# EAGLE design Blutdruck (EAGLE 9.3.1)
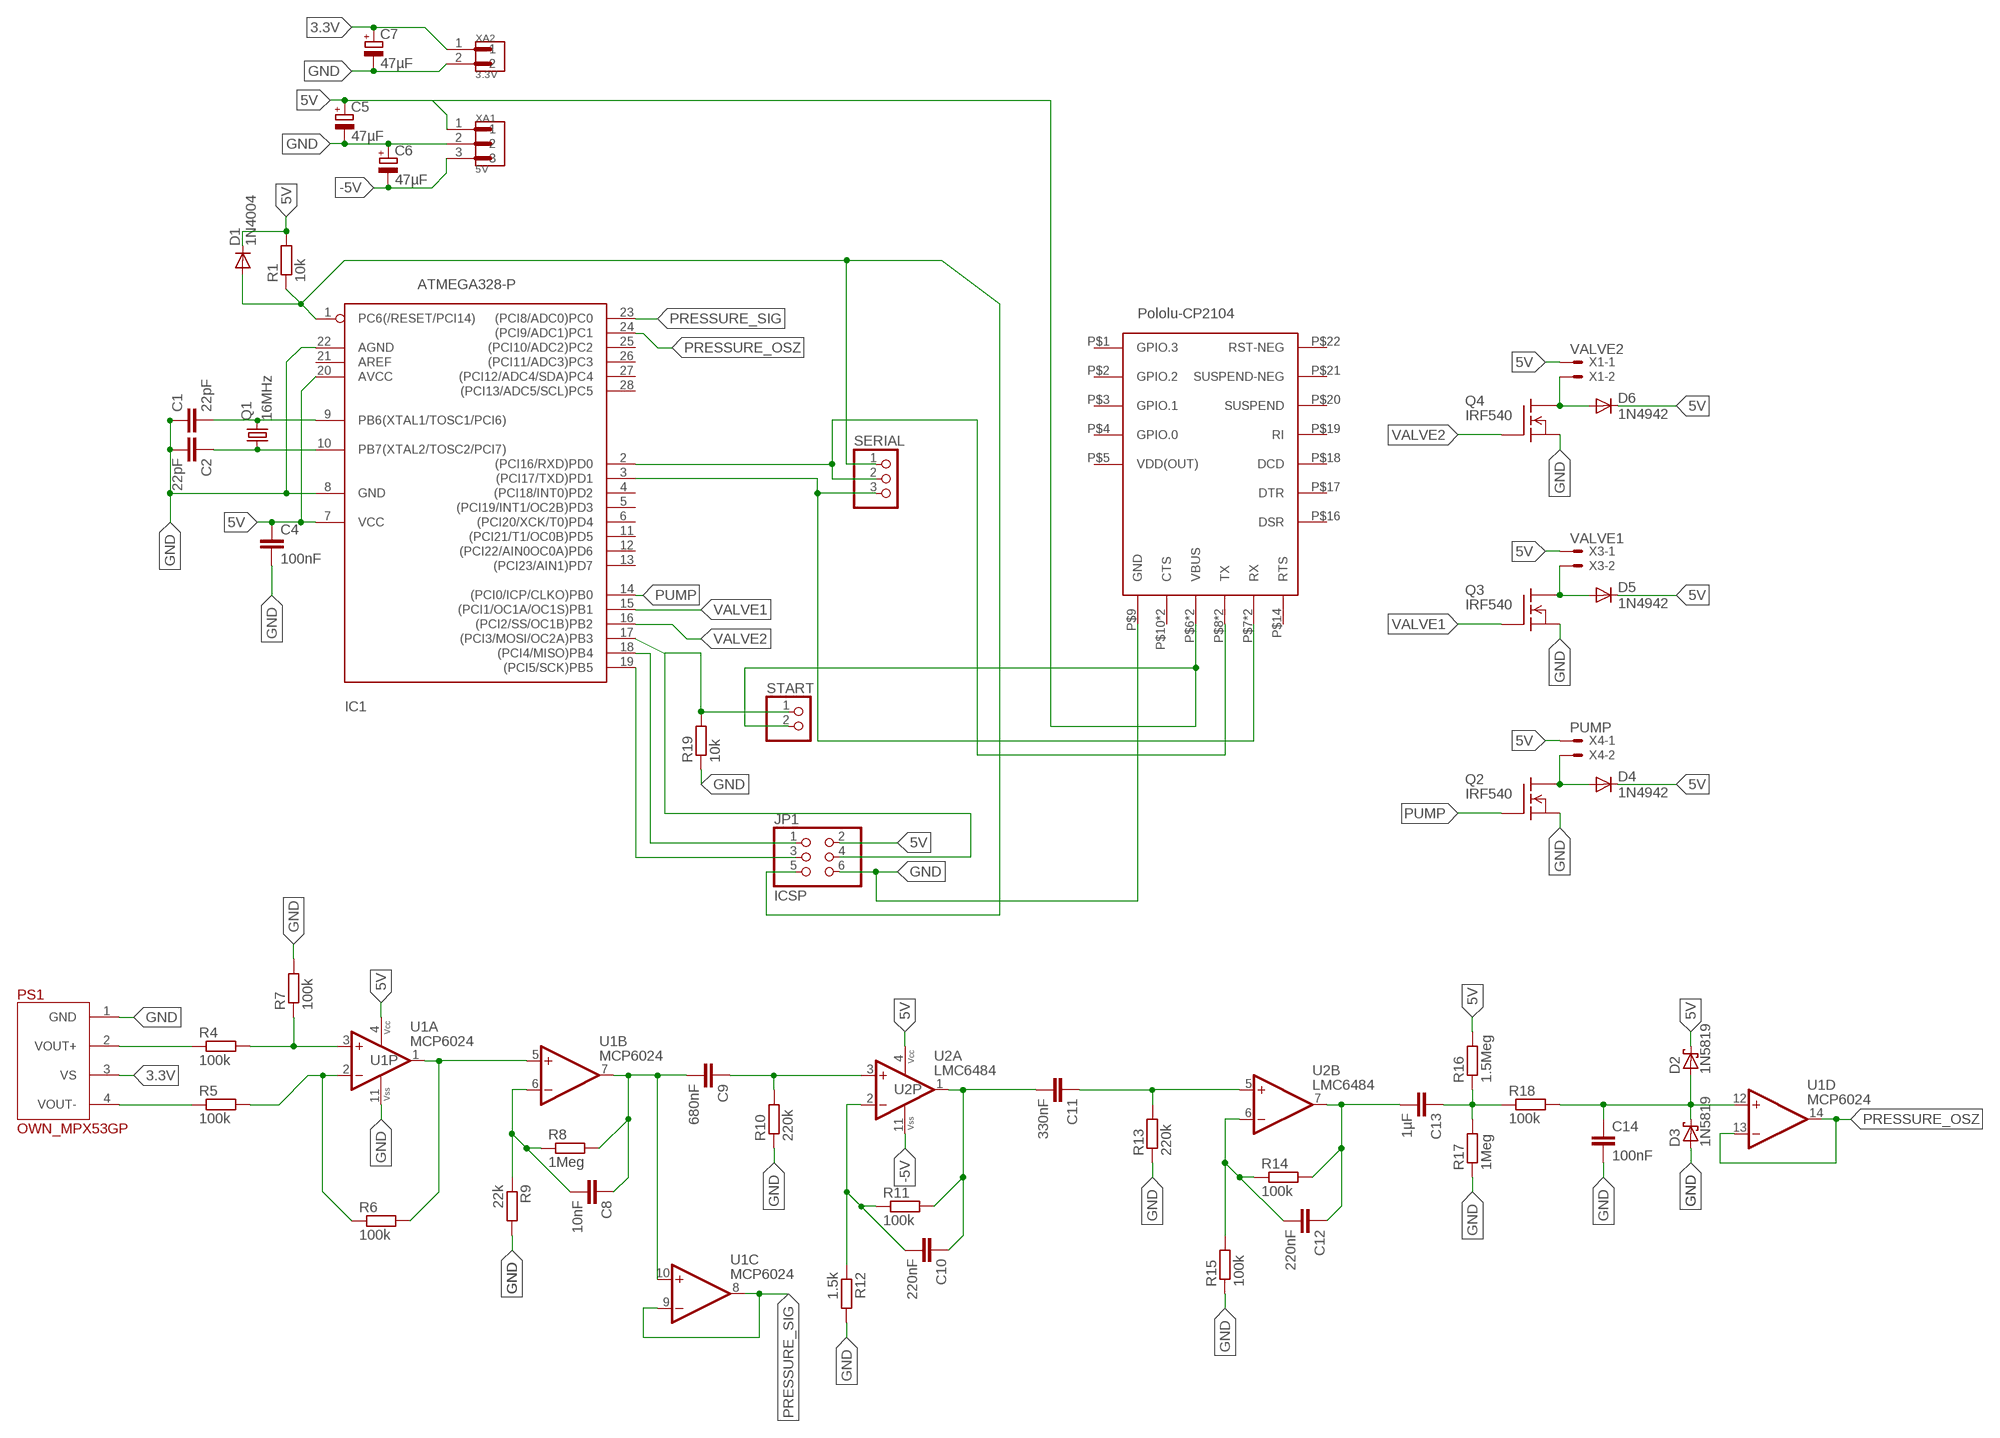
[diagram p0: schematic, sheet 1]

## Parts
C1  22pF  C-EU025-024X044  [C025-024X044]
C2  22pF  C-EU025-024X044  [C025-024X044]
C4  100nF  C-EU025-024X044  [C025-024X044]
C5  47µF  CPOL-EUE2,5-6E  [E2,5-6E]
C6  47µF  CPOL-EUE2,5-6E  [E2,5-6E]
C7  47µF  CPOL-EUE2,5-6E  [E2,5-6E]
C8  10nF  C-EU025-024X044  [C025-024X044]
C9  680nF  C-EU150-064X183  [C150-064X183]
C10  220nF  C-EU025-024X044  [C025-024X044]
C11  330nF  C-EU050-030X075  [C050-030X075]
C12  220nF  C-EU025-024X044  [C025-024X044]
C13  1µF  C-EU150-072X183  [C150-072X183]
C14  100nF  C-EU025-024X044  [C025-024X044]
D1  1N4004  [DO41-10]
D2  1N5819  SCHOTTKY-DIODEF126Z12  [F126Z12]
D3  1N5819  SCHOTTKY-DIODEF126Z12  [F126Z12]
D4  1N4942  [DO41-10]
D5  1N4942  [DO41-10]
D6  1N4942  [DO41-10]
IC1  ATMEGA328-P  ATMEGA168-20P  [DIL28-3]
JP1  ICSP  PINHD-2X3  [2X03]
PS1  OWN_MPX53GP  [MPX53]
Q1  16MHz  CRYSTALHC49U70  [HC49U70]
Q2  IRF540  [TO220]
Q3  IRF540  [TO220]
Q4  IRF540  [TO220]
R1  10k  R-EU_0204/7  [0204/7]
R4  100k  R-EU_0204/7  [0204/7]
R5  100k  R-EU_0204/7  [0204/7]
R6  100k  R-EU_0204/7  [0204/7]
R7  100k  R-EU_0204/7  [0204/7]
R8  1Meg  R-EU_0204/7  [0204/7]
R9  22k  R-EU_0204/7  [0204/7]
R10  220k  R-EU_0204/7  [0204/7]
R11  100k  R-EU_0204/7  [0204/7]
R12  1.5k  R-EU_0204/7  [0204/7]
R13  220k  R-EU_0204/7  [0204/7]
R14  100k  R-EU_0204/7  [0204/7]
R15  100k  R-EU_0204/7  [0204/7]
R16  1.5Meg  R-EU_0204/7  [0204/7]
R17  1Meg  R-EU_0204/7  [0204/7]
R18  100k  R-EU_0204/7  [0204/7]
R19  10k  R-EU_0204/7  [0204/7]
SERIAL  PINHD-1X3  [1X03]
START  PINHD-1X2  [1X02]
U1  MCP6024  LMV824  [DIL14]
U2  LMC6484  LMV824  [DIL14]
U$1  POLOLU_CP2104  [POLOLUCP2104]
X1  VALVE2  JST-XH-02-PIN-LONG-PAD  [JST-XH-02-PACKAGE-LONG-PAD]
X3  VALVE1  JST-XH-02-PIN-LONG-PAD  [JST-XH-02-PACKAGE-LONG-PAD]
X4  PUMP  JST-XH-02-PIN-LONG-PAD  [JST-XH-02-PACKAGE-LONG-PAD]
XA1  5V  B3P-VH(LF)(SN)  [JST_B3P-VH(LF)(SN)]
XA2  3.3V  B2P-VH(LF)(SN)  [JST_B2P-VH(LF)(SN)]

## Nets
3.3V [supply]: C7.+ PS1.3(VS) XA2.1
5V [supply]: C4.1 C5.+ D1.C D2.C D4.C D5.C D6.C IC1.7(VCC) IC1.20(AVCC) JP1.2 R1.2 R16.2 START.2 U1.4(P:VCC+) U2.4(P:VCC+) U$1.P$6(VBUS) U$1.P$11(VBUS) X1.1 X3.1 X4.1 XA1.1
-5V [supply]: C6.- U2.11(P:VCC-) XA1.3
GND [supply]: C1.1 C2.2 C4.2 C5.- C6.+ C7.- C14.2 D3.A IC1.8(GND) IC1.22(AGND) JP1.6 PS1.1(GND) Q2.3(S) Q3.3(S) Q4.3(S) R7.2 R9.2 R10.1 R12.2 R13.1 R15.1 R17.1 R19.1 U1.11(P:VCC-) U$1.P$9(GND) XA1.2 XA2.2
N$1: PS1.2(VOUT+) R4.1
N$2: R4.2 R7.1 U1.3(A:+IN)
N$3: PS1.4(VOUT-) R5.1
N$4: R5.2 R6.1 U1.2(A:-IN)
N$5: R6.2 U1.1(A:OUT) U1.5(B:+IN)
N$6: C8.2 R8.1 R9.1 U1.6(B:-IN)
N$7: C8.1 C9.2 R8.2 U1.7(B:OUT) U1.10(C:+IN)
N$8: C9.1 R10.2 U2.3(A:+IN)
N$9: C10.2 R11.1 R12.1 U2.2(A:-IN)
N$10: C10.1 C11.2 R11.2 U2.1(A:OUT)
N$11: C11.1 R13.2 U2.5(B:+IN)
N$12: C12.2 R14.1 R15.2 U2.6(B:-IN)
N$13: C12.1 C13.2 R14.2 U2.7(B:OUT)
N$14: C13.1 R16.1 R17.2 R18.1
N$15: C14.1 D2.A D3.C R18.2 U1.12(D:+IN)
N$16: D4.A Q2.2(D) X4.2
N$17: D5.A Q3.2(D) X3.2
N$18: D6.A Q4.2(D) X1.2
N$19: IC1.17((PCI3/MOSI/OC2A)PB3) JP1.4 R19.2 START.1
N$20: IC1.2((PCI16/RXD)PD0) SERIAL.2 U$1.P$8(TX) U$1.P$12(TX)
N$21: IC1.3((PCI17/TXD)PD1) SERIAL.3 U$1.P$7(RX) U$1.P$13(RX)
N$26: C1.2 IC1.9(PB6(XTAL1/TOSC1/PCI6)) Q1.2
N$27: C2.1 IC1.10(PB7(XTAL2/TOSC2/PCI7)) Q1.1
N$30: IC1.18((PCI4/MISO)PB4) JP1.1
N$31: IC1.19((PCI5/SCK)PB5) JP1.3
PRESSURE_OSZ: IC1.24((PCI9/ADC1)PC1) U1.13(D:-IN) U1.14(D:OUT)
PRESSURE_SIG: IC1.23((PCI8/ADC0)PC0) U1.8(C:OUT) U1.9(C:-IN)
PUMP: IC1.14((PCI0/ICP/CLKO)PB0) Q2.1(G)
RESET: D1.A IC1.1(PC6(/RESET/PCI14)) JP1.5 R1.1 SERIAL.1
VALVE1: IC1.15((PCI1/OC1A/OC1S)PB1) Q3.1(G)
VALVE2: IC1.16((PCI2/SS/OC1B)PB2) Q4.1(G)
Unconnected: IC1.4((PCI18/INT0)PD2) IC1.5((PCI19/INT1/OC2B)PD3) IC1.6((PCI20/XCK/T0)PD4) IC1.11((PCI21/T1/OC0B)PD5) IC1.12((PCI22/AIN0OC0A)PD6) IC1.13((PCI23/AIN1)PD7) IC1.21(AREF) IC1.25((PCI10/ADC2)PC2) IC1.26((PCI11/ADC3)PC3) IC1.27((PCI12/ADC4/SDA)PC4) IC1.28((PCI13/ADC5/SCL)PC5) U2.8(C:OUT) U2.9(C:-IN) U2.10(C:+IN) U2.12(D:+IN) U2.13(D:-IN) U2.14(D:OUT) U$1.P$1(GPIO.3) U$1.P$2(GPIO.2) U$1.P$3(GPIO.1) U$1.P$4(GPIO.0) U$1.P$10(CTS) U$1.P$14(RTS) U$1.P$15(CTS) U$1.P$16(DSR) U$1.P$17(DTR) U$1.P$18(DCD) U$1.P$19(RI) U$1.P$20(SUSPEND) U$1.P$21(SUSPEND-NEG) U$1.P$22(RST-NEG)

## Power pins joined to a net without a drawn wire
VDD(OUT): U$1.P$5(VDD(OUT))

## Library data of the parts
C1 C2 C4 C8-C14 = rcl:C-EU: CAPACITOR, European symbol; SPICEPREFIX: C
C5-C7 = rcl:CPOL-EU: POLARIZED CAPACITOR, European symbol; SPICEPREFIX: C
D1 = diode:1N4004: DIODE general purpose rectifier, 1 A
D2 D3 = diode:SCHOTTKY-DIODE: Schottky Diode
D4-D6 = diode:1N4942: DIODE 1.0 A, 200 V, 150 ns
IC1 = adafruit:ATMEGA168*P: MICROCONTROLLER 16 kBytes FLASH 1 kBytes SRAM 512 Bytes EEPROM USART 8-channel 10 bit ADC
JP1 = pinhead:PINHD-2X3: PIN HEADER
PS1 = OWN_MXP53GP:OWN_MPX53GP
Q1 = adafruit:CRYSTAL: CRYSTAL; OC_FARNELL: unknown; OC_NEWARK: unknown
Q2-Q4 = transistor-fet:IRF540: N-Channel Enhancement MOSFET (HEXFET); 100V; 28A; 0,077Ohm
R1 R4-R19 = rcl:R-EU_: RESISTOR, European symbol; SPICEPREFIX: R
SERIAL = pinhead:PINHD-1X3: PIN HEADER
START = pinhead:PINHD-1X2: PIN HEADER
U1 U2 = op-amp:LMV824: OP-AMP - Low Voltage Rail-to-Rail
U$1 = POLOLU_CP2104:POLOLU_CP2104: TTL zu USB Konverter
X1 X3 X4 = Rembrandt Electronics - JST XH Connectors v1-0:JST-XH-02-PIN: JST XH Connector 2 Pin Wire to board connector. Pitch: 2,54 mm, (0.100") Number of pins: 2 Created by Rembrandt Electronics www.rembrandtelectronics.com
XA1 = B3P-VH_LF__SN_:B3P-VH(LF)(SN): VH Series 3 Position 3.96 mm Pitch Through Hole Crimp Locking Header; AVAILABILITY: Good; DESCRIPTION: VH Series 3 Position 3.96 mm Pitch Through Hole Crimp Locking Header; MF: JST; MP: B3P-VH_LF__SN_; PACKAGE: FakePackage u; PRICE: 0.12 USD
XA2 = B2P-VH_LF__SN_:B2P-VH(LF)(SN): VH Series 3.96 mm Pitch, Compact, Lock Mechanism also Prevents Misinsertion; AVAILABILITY: Good; DESCRIPTION: VH Series 3.96 mm Pitch, Compact, Lock Mechanism also Prevents Misinsertion; MF: JST; MP: B2P-VH_LF__SN_; PACKAGE: FakePackage u; PRICE: 0.11 USD

## Net classes
0 signals: width 0.406 mm, clearance 0.305 mm
1 supply: width 0.61 mm, clearance 0.406 mm

## Board
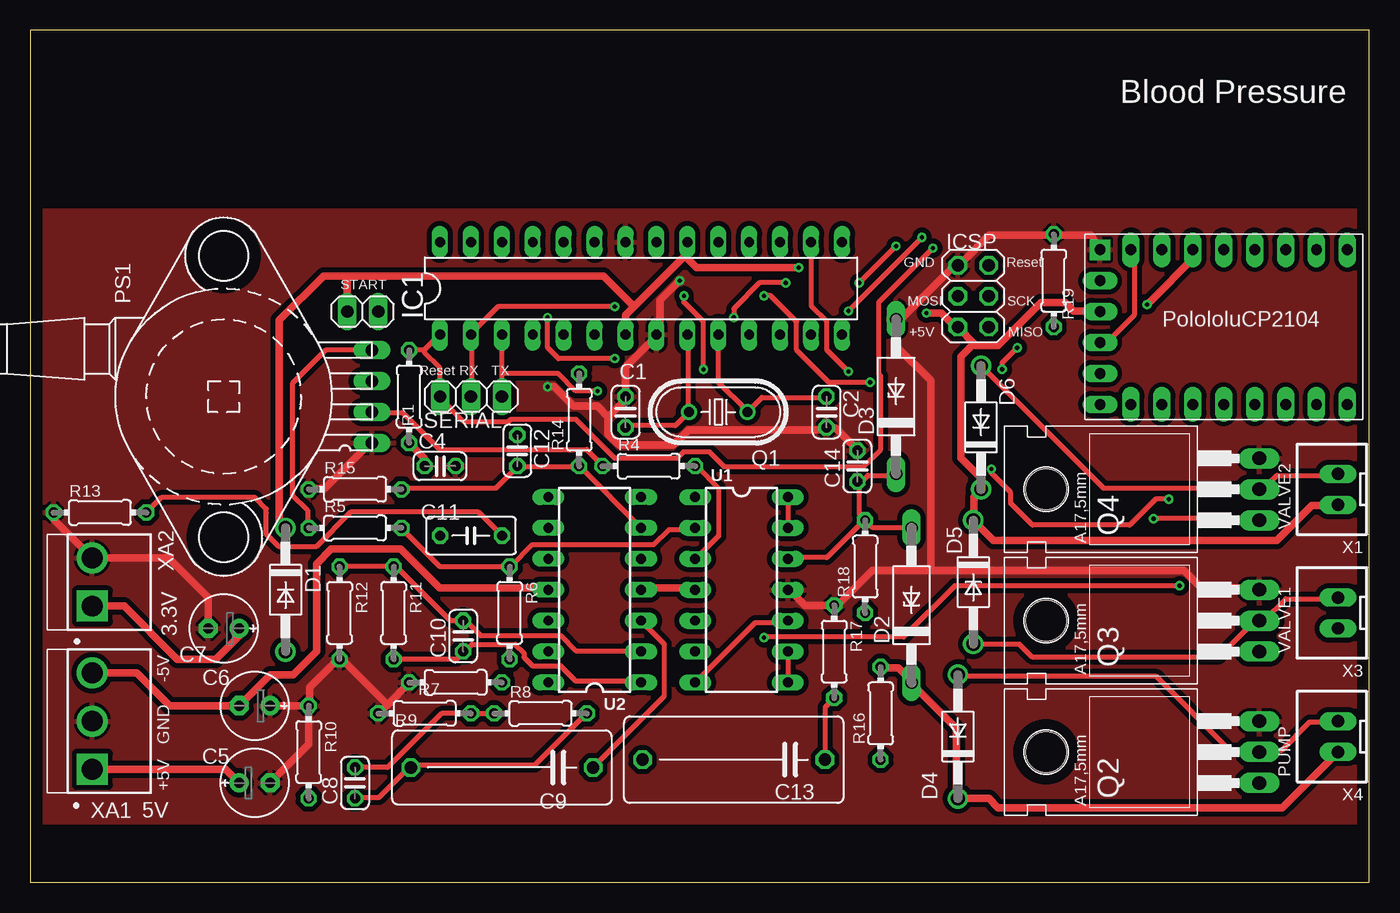
[diagram p1: board, top side]
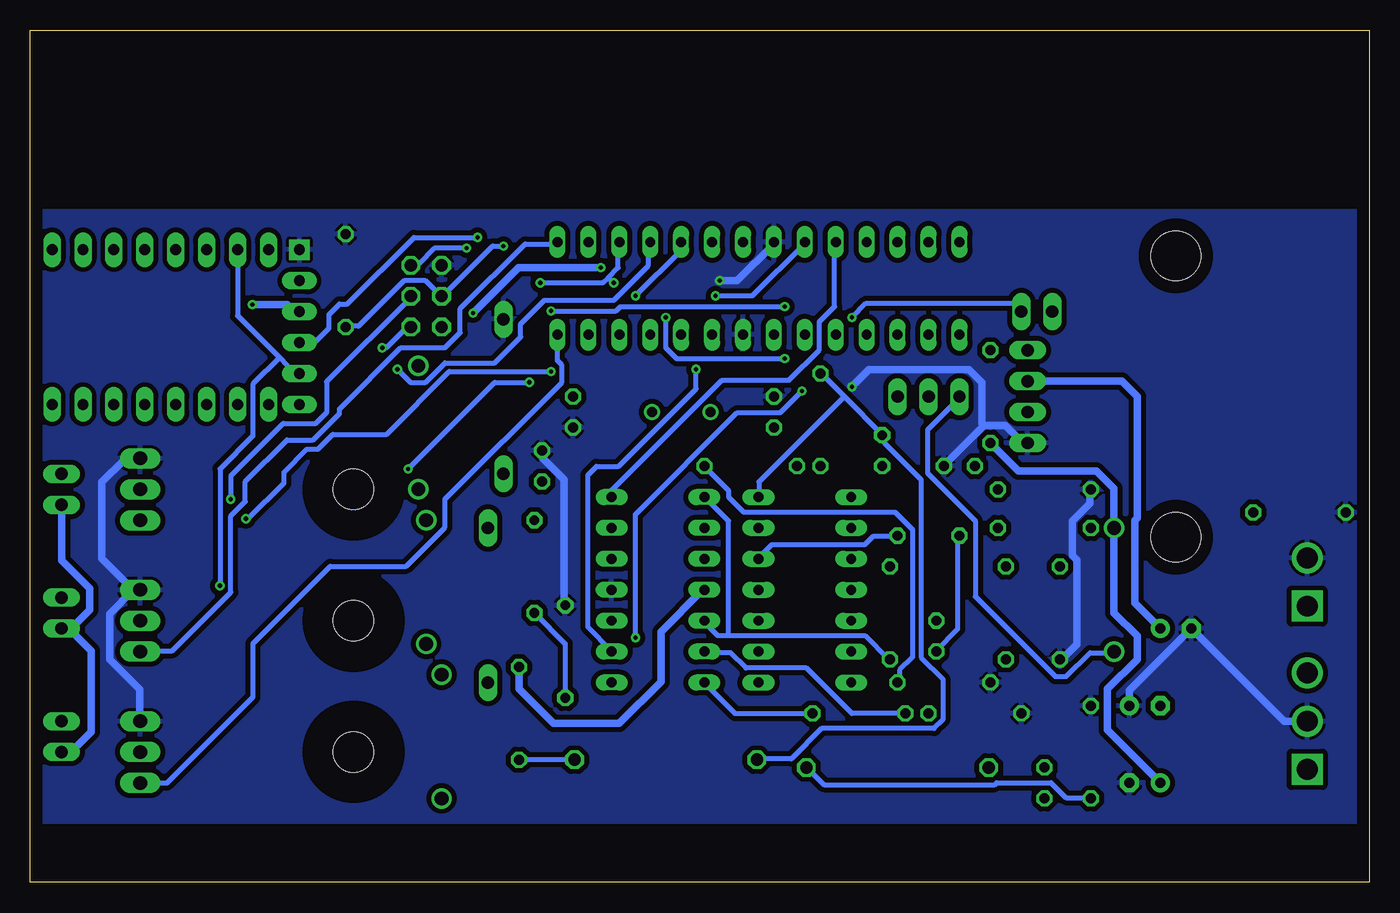
[diagram p2: board, bottom side, seen from below]

Size 109.98 x 70.01 mm. Coordinates in mm from the lower left corner, seen from the top.
Outline: 0,0 109.98,0 109.98,70.01 0,70.01 0,0
Copper layers (1*16): Top 0.035mm / dielectric 1.5mm / Bottom 0.035mm
Design rules "default": minimum track width 6mil, minimum drill 0.35mm, track to track 6mil, track to pad 6mil, pad to pad 6mil, via to via 6mil, smd to smd 6mil, copper to edge 40mil, drill to drill 6mil, minimum pad ring 10mil, minimum via ring 8mil, stop-mask expansion 4mil, vias tented up to drill 0mil, thermal gap 10mil

### Footprints (pad centres in the part's own frame; a part is rotated, then mirrored left to right if it is on the bottom)
C025-024X044 = drill 0.813 octagon: 1 -1.27,0; 2 1.27,0
E2,5-6E = drill 0.813 pad 1.575: + -1.27,0 | drill 0.813 pad 1.575 octagon: - 1.27,0
C150-064X183 = drill 1.016 octagon: 1 -7.493,0; 2 7.493,0
C050-030X075 = drill 0.813 octagon: 1 -2.54,0; 2 2.54,0
C150-072X183 = drill 1.016 octagon: 1 -7.493,0; 2 7.493,0
DO41-10 = drill 1.118: A 5.08,0; C -5.08,0
F126Z12 = drill 1.016 long: A 6.35,0; C -6.35,0
DIL28-3 = drill 0.813 long: 1 -16.51,-3.81; 2 -13.97,-3.81; 3 -11.43,-3.81; 4 -8.89,-3.81; 5 -6.35,-3.81; 6 -3.81,-3.81; 7 -1.27,-3.81; 8 1.27,-3.81; 9 3.81,-3.81; 10 6.35,-3.81; 11 8.89,-3.81; 12 11.43,-3.81; 13 13.97,-3.81; 14 16.51,-3.81; 15 16.51,3.81; 16 13.97,3.81; 17 11.43,3.81; 18 8.89,3.81; 19 6.35,3.81; 20 3.81,3.81; 21 1.27,3.81; 22 -1.27,3.81; 23 -3.81,3.81; 24 -6.35,3.81; 25 -8.89,3.81; 26 -11.43,3.81; 27 -13.97,3.81; 28 -16.51,3.81
2X03 = drill 1.016 octagon: 1 -2.54,-1.27; 2 -2.54,1.27; 3 0,-1.27; 4 0,1.27; 5 2.54,-1.27; 6 2.54,1.27
MPX53 = drill 1.016 long: 1 -3.81,-12.192; 2 -1.27,-12.192; 3 1.27,-12.192; 4 3.81,-12.192 | hole 4.064: -11.557,0; 11.557,0
HC49U70 = drill 0.813: 1 -2.413,0; 2 2.413,0
TO220 = drill 1.118 long: 1 -2.54,-6.35; 2 0,-6.35; 3 2.54,-6.35 | hole 3.302: 0,11.176
0204/7 = drill 0.813 octagon: 1 -3.81,0; 2 3.81,0
1X03 = drill 1.016 long: 1 -2.54,0; 2 0,0; 3 2.54,0
1X02 = drill 1.016 long: 1 -1.27,0; 2 1.27,0
DIL14 = drill 0.813 long: 1 -7.62,-3.81; 2 -5.08,-3.81; 3 -2.54,-3.81; 4 0,-3.81; 5 2.54,-3.81; 6 5.08,-3.81; 7 7.62,-3.81; 8 7.62,3.81; 9 5.08,3.81; 10 2.54,3.81; 11 0,3.81; 12 -2.54,3.81; 13 -5.08,3.81; 14 -7.62,3.81
POLOLUCP2104 = drill 0.9 pad 1.422 long: P$1 1.27,-1.27; P$2 1.27,-3.81; P$3 1.27,-6.35; P$4 1.27,-8.89; P$5 1.27,-11.43; P$6 1.27,-13.97; P$7 1.27,-16.51; P$8 1.27,-19.05; P$10 3.81,-21.59; P$11 6.35,-21.59; P$12 8.89,-21.59; P$13 11.43,-21.59; P$14 13.97,-21.59; P$15 13.97,-19.05; P$16 13.97,-16.51; P$17 13.97,-13.97; P$18 13.97,-11.43; P$19 13.97,-8.89; P$20 13.97,-6.35; P$21 13.97,-3.81; P$22 13.97,-1.27 | drill 0.9 pad 1.676 square: P$9 1.27,-21.59
JST-XH-02-PACKAGE-LONG-PAD = drill 1.016 long: 1 -1.27,0; 2 1.27,0
JST_B3P-VH(LF)(SN) = drill 1.7 square: 1 -3.96,0 | drill 1.7: 2 0,0; 3 3.96,0
JST_B2P-VH(LF)(SN) = drill 1.7 square: 1 -1.98,0 | drill 1.7: 2 1.98,0

### Placement (x,y rotation side)
C1  48.9,38.65 270 top
C2  65.41,38.65 270 top
C4  33.66,34.21 0 top
C5  18.41,8.17 0 top
C6  18.41,14.52 180 top
C7  15.88,20.87 180 top
C8  26.67,8.17 90 top
C9  38.73,9.44 180 top
C10  35.56,20.24 90 top
C11  36.2,28.49 180 top
C12  40.01,35.48 270 top
C13  57.78,10.08 180 top
C14  67.94,34.21 90 top
D1  20.95,24.05 270 top
D2  72.39,22.78 90 top
D3  71.12,39.92 90 top
D4  76.2,11.98 90 top
D5  77.47,24.68 270 top
D6  78.11,37.38 90 top
IC1  50.16,48.81 0 top
JP1  77.47,48.18 90 top
PS1  15.88,39.92 90 top
Q1  56.52,38.65 180 top
Q2  94.61,10.71 90 top
Q3  94.61,21.51 90 top
Q4  94.61,32.3 90 top
R1  31.11,39.92 270 top
R4  50.8,34.21 0 top
R5  26.67,29.13 0 top
R6  39.37,22.14 270 top
R7  34.92,16.43 180 top
R8  41.91,13.89 0 top
R9  32.38,13.89 180 top
R10  22.86,10.71 270 top
R11  29.84,22.14 270 top
R12  25.4,22.14 270 top
R13  5.71,30.4 0 top
R14  45.09,38.02 90 top
R15  26.67,32.3 0 top
R16  69.85,13.89 90 top
R17  66.04,18.97 270 top
R18  68.58,25.95 90 top
R19  84.07,49.45 270 top
SERIAL  36.2,39.92 0 top
START  27.3,46.91 180 top
U1  58.42,24.05 270 top
U2  46.35,24.05 90 top
U$1  109.47,53.26 270 top
X1  107.44,32.3 90 top
X3  107.44,22.14 90 top
X4  107.44,11.98 90 top
XA1  5.08,13.25 90 top
XA2  5.08,24.68 90 top

### Tracks (layer width: path | path; a pad name or v marks a point on that pad's centre or on a via)
3.3V
  Top 0.61: XA2.1 7.7,22.7 12.06,18.33 15.24,18.33 17.14,20.24 C7.+
  Bottom 0.61: 27.91,41.09 PS1.3 20.32,41.19 19.05,39.92 19.05,29.93 19.23,29.76 19.23,22.96 C7.+
5V  (via drill 0.35)
  Top 0.61: IC1.7 48.9,46.6 49.61,47.31 | 49.61,47.31 53.87,51.58 53.87,52.47 IC1.20 53.98,51.28 54.74,50.52 v63.12,50.52 | R1.2 32.36,34.87 32.36,34.34 C4.1 | 26.04,49.83 START.2 | D1.C 20.8,29.18 20.45,29.53 20.45,46.2 24.08,49.83 26.04,49.83 | 49.61,47.31 47.09,49.83 26.04,49.83 | U2.4 50.32,24.2 54.59,24.2 U1.4 | R16.2 69.88,17.62 71.3,17.62 72.36,16.56 D2.C 72.54,16.2 76.1,12.64 76.1,6.95 D4.C 78.74,6.9 79.5,6.14 102.87,6.14 X4.1 | 77.52,44.29 76.28,45.54 JP1.2 75.92,45.71 74.85,46.78 v73.61,46.78 | 77.52,44.29 77.7,44.11 79.48,44.11 83.01,47.65 85.01,47.65 85.7,46.96 87.81,46.96 U$1.P$11 | v91.75,47.49 95.83,51.58 95.83,51.66 U$1.P$6 | 77.52,44.29 76.45,43.23 76.45,34.87 78.05,33.27 78.05,32.56 D6.C 78.05,32.2 77.52,31.67 77.52,29.89 D5.C 79.12,28.11 102.41,28.11 105.26,30.96 107.42,30.96 X1.1 | XA1.1 16.02,9.29 C5.+
  Bottom 0.61: R1.2 28.8,33.8 22.4,33.8 20.98,32.38 20.98,29.18 D1.C | 20.98,28.82 D1.C | R16.2 69.85,15.9 67,13.05 61.62,13.05 58.19,16.48 58.19,20.59 54.76,24.02 U1.4 | X4.1 107.42,10.87 106.5,10.87 104.98,12.39 104.98,19.02 106.83,20.87 X3.1 106.63,20.87 105.11,22.4 105.11,24.15 107.42,26.46 107.42,31.01 X1.1 | v91.75,47.49 88.9,47.49 88.75,47.34 U$1.P$11 | v63.12,50.52 69.88,50.52 v73.61,46.78 | D1.C 20.95,22.14 19.05,20.24 19.05,18.33 21.49,15.9 21.49,12.52 C5.+
-5V
  Top 0.61: U2.11 42.49,24.2 33.6,24.2 30.4,27.4 24.71,27.4 23.5,26.18 23.5,18.97 21.59,17.06 19.68,17.06 C6.- 11.43,14.52 8.74,17.21 XA1.3
GND  (via drill 0.35)
  Top 0.61: R15.1 22.94,32.38 24.18,32.38 27.91,36.11 PS1.1 | 29.34,14.6 31.11,16.38 R7.2 | 29.34,14.6 28.63,13.89 R9.2 | R10.1 22.94,14.6 22.94,16.02 25.25,18.33 R12.2 25.6,18.33 29.34,14.6 | 22.58,14.6 R10.1 | U$1.P$9 87.24,53.07 87.12,53.18 84.15,53.18 R19.1 83.8,53.18 78.77,53.18 76.45,50.87 JP1.6 76.1,50.87 71.65,46.43 71.12,46.43 D3.A 71.12,44.09 73.97,41.24 73.97,25.62 | v53.34,49.45 51.74,47.85 51.74,45.18 IC1.8 51.56,45 48.9,42.34 C1.1 48.9,39.67 47.47,38.25 | C14.2 67.92,35.58 66.14,37.36 65.43,37.36 C2.2 65.25,37.18 54.05,37.18 52.81,35.94 48.36,35.94 47.47,36.82 47.47,38.25 | U1.11 62.23,24.2 63.65,22.78 R17.1 66.32,22.78 69.16,25.62 73.97,25.62 | 73.97,25.62 94.77,25.62 96.19,24.2 100.81,24.2 Q3.3 | v42.49,40.74 43.03,40.74 44.63,39.14 46.58,39.14 47.47,38.25 | C5.- 22.86,11.35 R10.1 | C6.+ R10.1 | C7.- 14.61,23.41 11.36,26.66 XA2.2 1.91,29.84 R13.1
  Bottom 0.61: 31.65,37.54 34.85,34.34 C4.2 | 31.65,37.54 29.87,37.54 28.45,36.11 PS1.1 | R15.1 22.94,32.2 22.94,31.14 24.36,29.71 24.36,26.87 24,26.51 24,19.58 25.25,18.33 R12.2 | Q2.3 100.99,13.36 100.99,15.84 103.48,18.33 103.48,22.07 101.52,24.02 100.99,24.02 Q3.3 101.7,24.2 104.11,26.61 104.11,32.91 102.34,34.69 100.99,34.69 Q4.3 | v53.34,49.45 51.92,49.45 48.9,52.47 IC1.22 | C14.2 67.92,35.4 67.92,34.87 66.14,33.09 66.14,22.78 R17.1 | v42.49,40.74 41.07,42.16 32.89,42.16 31.83,41.09 31.83,37.71 31.65,37.54 | C6.+ 19.68,15.79 C7.- 6.99,13.25 XA1.2
  pour Top: 0,5 110.49,5 110.49,55.16 0,55.16
  pour Bottom: 0,5 110.49,5 110.49,55.16 0,55.16
N$1
  Top 0.406: R4.1 46.94,34.34 45.7,35.58 33.6,35.58 30.58,38.6 28.09,38.6 PS1.2
N$2
  Top 0.406: U1.3 54.76,26.69 56.54,28.47 56.54,32.38 54.76,34.16 R4.2
  Bottom 0.406: R7.1 38.58,16.56 38.58,17.44 37.52,18.51 37.52,29 38.94,30.42 51.38,30.42 52.63,31.67 52.63,32.2 54.59,34.16 R4.2
N$3
  Top 0.406: PS1.4 24.26,43.73 21.51,40.99 21.51,31.85 22.76,30.6 22.76,29.18 R5.1
N$4
  Top 0.406: R5.2 30.58,29 33.6,25.98 39.29,25.98 R6.1 39.47,25.98 41.25,27.76 51.21,27.76 52.45,29 54.59,29 U1.2
N$5
  Bottom 0.406: 52.63,20.29 53.52,20.29 54.59,21.36 U1.5 | 52.63,20.29 41.43,20.29 39.47,18.33 R6.2 | 52.63,20.29 52.63,29.71 54.59,31.67 U1.1
N$6
  Top 0.406: C8.2 29.34,9.44 33.78,13.89 R9.1 R8.1
  Bottom 0.406: R8.1 42.49,13.89 46.23,17.62 51.21,17.62 52.45,18.87 54.59,18.87 U1.6
N$7
  Top 0.406: C8.1 26.67,6.95 28.63,6.95 31.11,9.44 C9.2 31.29,9.62 41.43,9.62 45.7,13.89 R8.2 | U1.10 62.23,21.36 59.56,21.36 54.76,16.56 U1.7
  Bottom 0.406: R8.2 52.09,13.89 54.59,16.38 U1.7
N$8
  Top 0.406: U2.3 52.09,19.58 52.09,15.31 C9.1
  Bottom 0.406: C9.1 44.81,8.02 30.76,8.02 30.58,8.2 26.14,8.2 24.89,6.95 22.94,6.95 R10.2
N$9
  Top 0.406: R12.1 25.43,25.98 29.69,25.98 R11.1 30.05,25.98 34.49,21.53 35.56,21.53 C10.2 35.74,21.53 36.98,20.29 43.56,20.29 44.81,19.04 50.14,19.04 U2.2
N$10
  Top 0.406: R11.2 35.03,18.33 35.56,18.87 C10.1 35.74,19.04 36.27,19.58 39.83,19.58 40.54,18.87 40.54,18.51 41.25,17.8 43.56,17.8 44.81,16.56 50.14,16.56 U2.1
  Bottom 0.406: C11.2 33.78,28.47 33.78,20.82 35.56,19.04 C10.1
N$11
  Top 0.406: C11.1 36.8,30.42 26.31,30.42 23.47,27.58 20.45,27.58 19.38,28.65 19.38,30.4 19.38,30.7 18.47,31.62 10.74,31.62 R13.2
  Bottom 0.406: C11.1 38.76,28.47 40.72,28.47 41.43,27.76 49.07,27.76 50.14,26.69 U2.5
N$12
  Top 0.406: R15.2 30.58,32.38 38.23,32.38 40.01,34.16 C12.2 40.18,34.16 44.98,34.16 R14.1 45.16,34.16 50.14,29.18 U2.6
N$13
  Bottom 0.406: 43.12,39.94 44.98,41.8 R14.2 | 43.12,39.94 40.01,36.82 C12.1 39.83,36.65 39.83,36.11 36.8,33.09 36.8,18.51 35.03,16.73 35.03,13.36 35.74,12.64 44.98,12.64 47.47,10.15 50.14,10.15 C13.2 | 43.12,39.94 50.14,32.91 50.14,31.67 U2.7
N$14
  Top 0.406: R17.2 65.28,14.4 C13.1
  Bottom 0.406: C13.1 R16.1 | R18.1 66.04,19.6 R17.2
N$15
  Top 0.406: U1.12 62.23,26.69 65.43,26.69 68.45,29.71 R18.2 | R18.2 68.1,30.25 68.1,32.91 C14.1 68.28,32.91 68.81,33.45 71.12,33.45 D3.C | R18.2 69.16,29.18 72.36,29.18 D2.A
N$16
  Top 0.406: X4.2 107.42,13.18 105.11,13.18 102.79,10.87 100.99,10.87 Q2.2 100.81,10.87 98.55,10.87 92.51,16.91 76.28,16.91 D4.A
N$17
  Top 0.406: X3.2 107.42,23.31 103.12,23.31 101.35,21.53 100.99,21.53 Q3.2 100.81,21.36 100.46,21.36 97.61,18.51 82.32,18.51 81.25,19.58 77.52,19.58 D5.A
N$18
  Top 0.406: X1.2 107.42,33.45 102.41,33.45 101.35,32.38 100.99,32.38 Q4.2 100.81,32.38 88.19,32.38 D6.A
N$19  (via drill 0.35)
  Top 0.406: v71.12,52.29 v68.1,49.27 | v42.49,46.43 42.49,43.94 43.38,43.05 v48.01,43.05 | v57.78,46.43 57.78,47.14 59.92,49.27 v62.05,49.27
  Bottom 0.406: 62.5,49.72 62.94,49.27 v68.1,49.27 | 62.5,49.72 61.7,50.52 61.7,52.47 IC1.17 | v71.12,52.29 72.01,52.29 76.1,48.2 JP1.4 76.28,48.2 77.52,49.45 79.3,49.45 83.03,45.71 83.97,45.71 R19.2 | v42.49,46.43 41.33,47.59 29.26,47.59 START.1 | v48.01,43.05 56.9,43.05 57.78,43.94 v57.78,46.43 | 62.5,49.72 v62.05,49.27
N$20  (via drill 0.35)
  Top 0.406: SERIAL.2 36.27,40.03 36.27,45 IC1.2 36.27,45.18 38.41,47.31 v48.01,47.31 | U$1.P$12 88.44,44.37 90.68,46.6 90.68,51.89 U$1.P$8 | v73.25,53 v67.21,46.96
  Bottom 0.406: v48.01,47.31 61.52,47.31 61.87,46.96 v67.21,46.96 | v73.25,53 78.46,53 83.94,47.54 84.58,47.54 85.45,46.68 85.45,45.54 86.61,44.37 U$1.P$12
N$21  (via drill 0.35)
  Top 0.406: 38.76,41.8 38.76,40.03 SERIAL.3 | 38.76,41.8 38.76,45 IC1.3 | 38.76,41.8 43.38,41.8 44.81,40.38 v46.58,40.38 | v60.27,20.11 60.33,20.16 71.73,20.16 75.95,24.38 v94.41,24.38
  Bottom 0.406: 89.52,43.14 92.96,46.58 U$1.P$7 | 89.52,43.14 88.88,42.49 U$1.P$13 | v46.58,40.38 48.36,38.6 51.92,38.6 60.27,30.25 v60.27,20.11 | v94.41,24.38 94.41,33.98 91.72,36.67 91.72,40.94 89.52,43.14
N$26
  Top 0.406: C1.2 48.9,37.54 52.98,37.54 Q1.2 54.05,38.78 54.05,45 IC1.9
N$27
  Top 0.406: IC1.10 56.54,45 56.54,41.09 58.85,38.78 Q1.1 59.03,38.78 60.1,39.85 65.25,39.85 C2.1
N$30  (via drill 0.35)
  Top 0.406: v79.83,42.16 79.83,42.69 v81.08,43.94
  Bottom 0.406: v79.83,42.16 78.77,41.09 77.52,41.09 75.92,42.69 71.83,42.69 69.7,44.83 69.7,45.89 67.74,47.85 62.05,47.85 59.21,50.69 59.21,52.47 IC1.18 | v81.08,43.94 80.72,43.94 79.12,45.54 78.77,45.54 JP1.1
N$31  (via drill 0.35)
  Top 0.406: v60.27,48.2 60.81,48.2 62.94,46.07 62.94,43.76 65.61,41.09 v68.99,41.09 | v78.94,33.98 78.94,33.62 80.54,32.02 80.54,31.14 82.32,29.36 90.32,29.36 92.46,31.49 v93.52,31.49
  Bottom 0.406: v60.27,48.2 56.54,51.94 56.54,52.47 IC1.19 | v68.99,41.09 71.83,41.09 v78.94,33.98 | v93.52,31.49 93.52,33.4 89.2,37.71 86.54,37.71 85.65,38.6 85.65,41.14 78.77,48.03 JP1.3
PRESSURE_OSZ
  Top 0.406: U1.14 U1.13
  Bottom 0.406: U1.14 62.23,32.2 53.16,41.27 47.65,41.27 45.16,43.76 45.16,46.07 43.92,47.31 43.92,52.47 IC1.24
PRESSURE_SIG  (via drill 0.35)
  Top 0.406: U1.9 U1.8 | v53.7,48.2 53.7,47.67 55.3,46.07 v55.3,42.16
  Bottom 0.406: v53.7,48.2 50.67,48.2 46.41,52.47 IC1.23 | v55.3,42.16 55.3,40.56 61.67,34.18 63.48,34.18 64.19,33.47 64.19,21 62.23,19.04 U1.9
PUMP
  Bottom 0.406: IC1.14 66.67,42.87 66.32,42.51 66.32,41.09 75.92,31.49 75.92,29.18 79.12,25.98 85.34,25.98 91.69,19.63 91.69,15.23 98.75,8.17 Q2.1
RESET  (via drill 0.35)
  Top 0.406: 32.36,43.76 31.11,43.76 R1.1 | 32.36,43.76 33.6,45 IC1.1 | 32.36,43.76 32.36,43.58 33.6,42.34 33.6,40.03 SERIAL.1 33.6,39.85 35.56,37.89 39.29,37.89 39.47,38.07 44.81,38.07 48.01,34.87 53.16,34.87 53.7,35.4 55.75,35.4 57,34.16 68.45,34.16 69.88,35.58 69.88,41.63 69.7,41.8 69.7,47.67 v74.14,52.12
  Bottom 0.406: v74.14,52.12 76.81,52.12 78.05,50.87 78.59,50.87 JP1.5 | D1.A 20.98,18.87 22.94,18.87 24.89,16.91 25.78,16.91 32.36,23.49 32.36,29.71 36.27,33.62 36.27,37.18 33.6,39.85 SERIAL.1
VALVE1
  Bottom 0.406: IC1.15 66.67,52.47 69.34,52.47 74.68,47.14 74.68,45.18 75.92,43.94 79.55,43.94 84.58,38.91 84.58,38.53 86.74,36.37 88.9,36.37 92.33,32.94 92.33,31.29 93.52,30.09 93.52,23.85 98.32,19.04 100.81,19.04 Q3.1
VALVE2  (via drill 0.35)
  Top 0.406: v67.21,41.98 65.43,43.76 65.43,46.07 64.19,47.31 64.19,52.47 IC1.16 | v92.28,29.89 100.81,29.89 Q4.1
  Bottom 0.406: v67.21,41.98 75.56,41.98 80.72,36.82 85.14,36.82 86.36,35.61 87.25,35.61 89.15,33.7 89.15,32.81 92.08,29.89 | v92.28,29.89 92.08,29.89 | 92.08,29.89

### Text on the board
tNames: Blood Pressure | GND | Reset | MOSI | SCK | +5V | MISO | Reset | RX | TX | 3.3V | -5V | GND | +5V